# Altium schematic sheet Main.SchDoc
size A
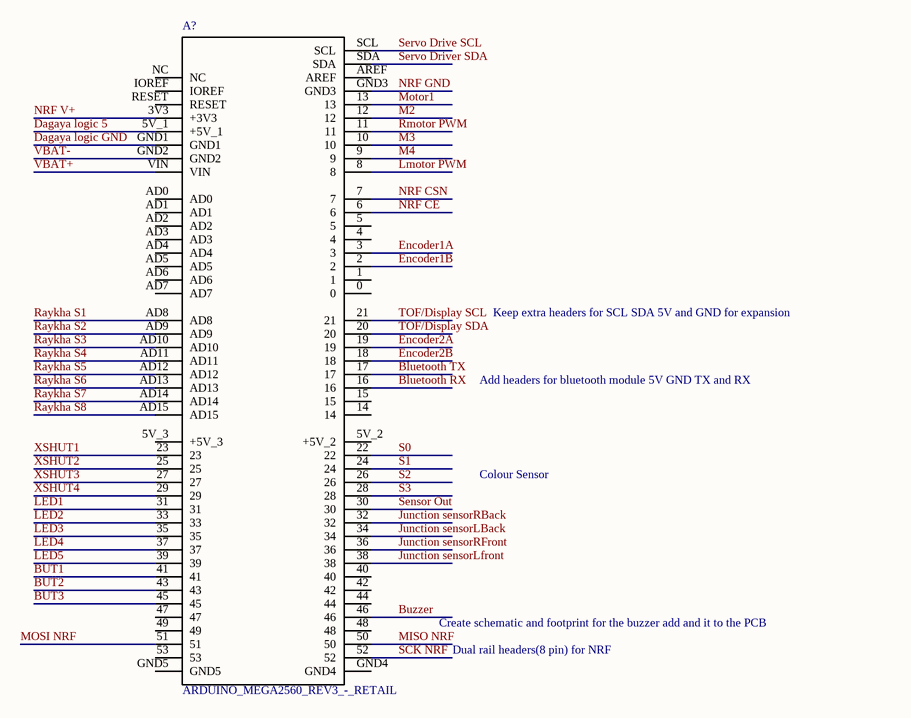
[diagram p0: Main.SchDoc]

## Parts
A?  ARDUINO_MEGA2560_REV3_-_RETAIL  [*ARDUINO_MEGA2560_REV3_-_RETAIL_ARDUINO_MEGA2560_REV3_-_RETAIL(Primary)]

## Nets
Bluetooth RX: A?.16
Bluetooth TX: A?.17
BUT1: A?.41
BUT2: A?.43
BUT3: A?.45
Buzzer: A?.46
Dagaya logic 5: A?.5V_1(+5V_1)
Dagaya logic GND: A?.GND1
Encoder1A: A?.3
Encoder1B: A?.2
Encoder2A: A?.19
Encoder2B: A?.18
Junction sensorLBack: A?.34
Junction sensorLfront: A?.38
Junction sensorRBack: A?.32
Junction sensorRFront: A?.36
LED1: A?.31
LED2: A?.33
LED3: A?.35
LED4: A?.37
LED5: A?.39
Lmotor PWM: A?.8
M2: A?.12
M3: A?.10
M4: A?.9
MISO NRF: A?.50
MOSI NRF: A?.51
Motor1: A?.13
NRF CE: A?.6
NRF CSN: A?.7
NRF GND: A?.GND3
NRF V+: A?.3V3(+3V3)
Raykha S1: A?.AD8
Raykha S2: A?.AD9
Raykha S3: A?.AD10
Raykha S4: A?.AD11
Raykha S5: A?.AD12
Raykha S6: A?.AD13
Raykha S7: A?.AD14
Raykha S8: A?.AD15
Rmotor PWM: A?.11
S0: A?.22
S1: A?.24
S2: A?.26
S3: A?.28
SCK NRF: A?.52
Sensor Out: A?.30
Servo Drive SCL: A?.SCL
Servo Driver SDA: A?.SDA
TOF/Display SCL: A?.21
TOF/Display SDA: A?.20
VBAT+: A?.VIN
VBAT-: A?.GND2
XSHUT1: A?.23
XSHUT2: A?.25
XSHUT3: A?.27
XSHUT4: A?.29

Not connected (* = marked no-connect by the designer): A? 0 1 4 5 5V_2(+5V_2) 5V_3(+5V_3) 14 15 40 42 44 47 48 49 53 AD0 AD1 AD2 AD3 AD4 AD5 AD6 AD7 AREF GND4 GND5 IOREF NC RESET

## Notes on the sheet
- Keep extra headers for SCL SDA 5V and GND for expansion
- Add headers for bluetooth module 5V GND TX and RX
- Colour Sensor
- Create schematic and footprint for the buzzer add and it to the PCB
- Dual rail headers(8 pin) for NRF

## Library data of the parts
A? = ARDUINO_MEGA2560_REV3_-_RETAIL: Dev.kit: Arduino; SPI, TWI, UART; ICSP, USB B, pin strips, supply; MP: ARDUINO MEGA2560 REV3 - RETAIL; Availability: Unavailable; Price: None; SnapEDA_Link: https://www.snapeda.com/parts/ARDUINO%20MEGA2560%20REV3%20-%20RETAIL/Arduino/view-part/?ref=snap; MF: Arduino; Package: None; Value: *